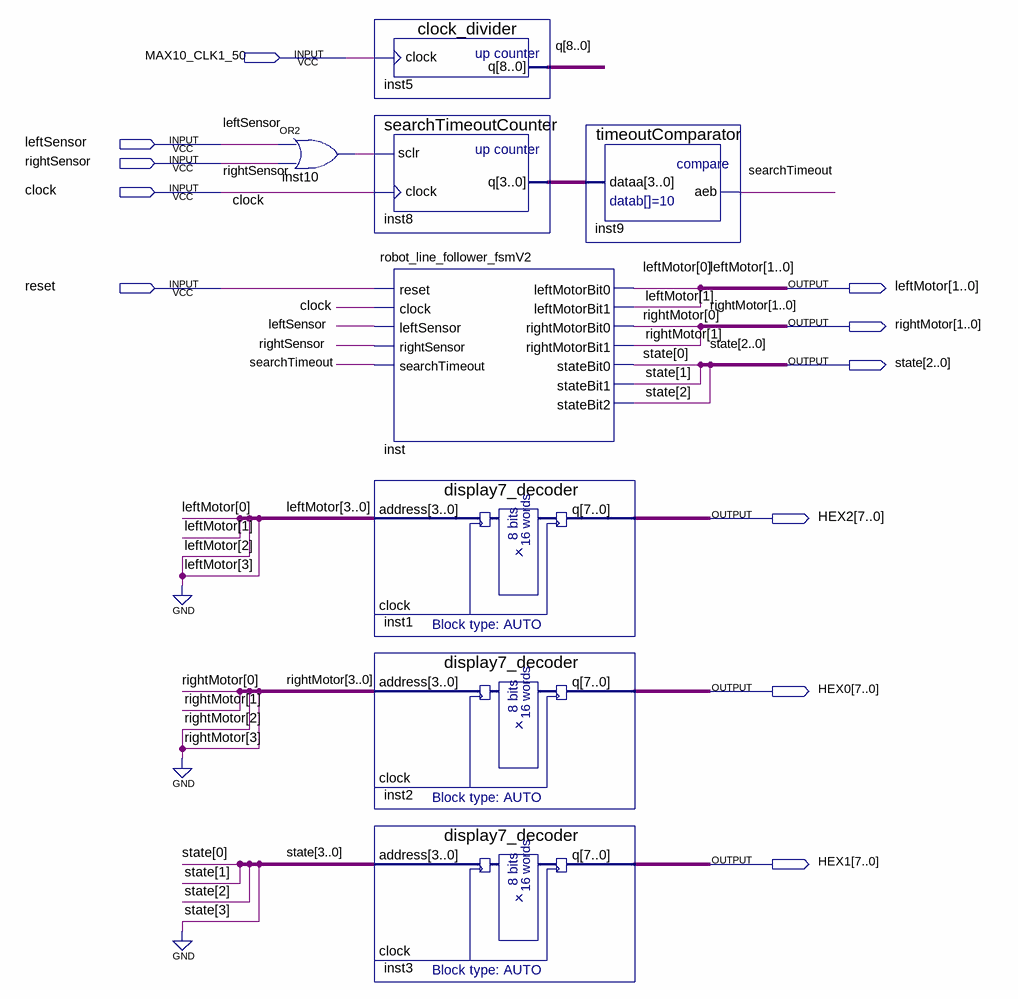
[diagram p0: schematic sheet]
// Quartus schematic block_diagram_V2.bdf as structural Verilog: 8 symbols, 11 pins
module block_diagram_V2 (
  input  MAX10_CLK1_50,
  input  leftSensor,
  input  rightSensor,
  input  clock,
  input  reset,
  output [1:0] leftMotor,
  output [1:0] rightMotor,
  output [2:0] state,
  output [7:0] HEX2,
  output [7:0] HEX0,
  output [7:0] HEX1
);

  wire inst10_out, searchTimeout;
  wire [3:0] inst8_q;
  wire [8:0] q;

  or inst10 (inst10_out, leftSensor, rightSensor);
  clock_divider inst5 (.clock(MAX10_CLK1_50), .q(q));
  searchTimeoutCounter inst8 (.sclr(inst10_out), .clock(clock), .q(inst8_q));
  robot_line_follower_fsmV2 inst (
    .reset(reset), .clock(clock), .leftSensor(leftSensor), .rightSensor(rightSensor),
    .searchTimeout(searchTimeout), .leftMotorBit0(leftMotor[0]), .leftMotorBit1(leftMotor[1]),
    .rightMotorBit0(rightMotor[0]), .rightMotorBit1(rightMotor[1]), .stateBit0(state[0]),
    .stateBit1(state[1]), .stateBit2(state[2]));
  display7_decoder inst1 (.address({2'b00, leftMotor}), .q(HEX2));  // open: clock
  display7_decoder inst2 (.address({2'b00, rightMotor}), .q(HEX0));  // open: clock
  display7_decoder inst3 (.address({1'b0, state}), .q(HEX1));  // open: clock
  timeoutComparator inst9 (.dataa(inst8_q), .aeb(searchTimeout));
endmodule
